# Altium schematic sheet 14_IO_MIPI.SchDoc
size A3; DocumentNumber: 14; SheetNumber: 14; SheetTotal: 21
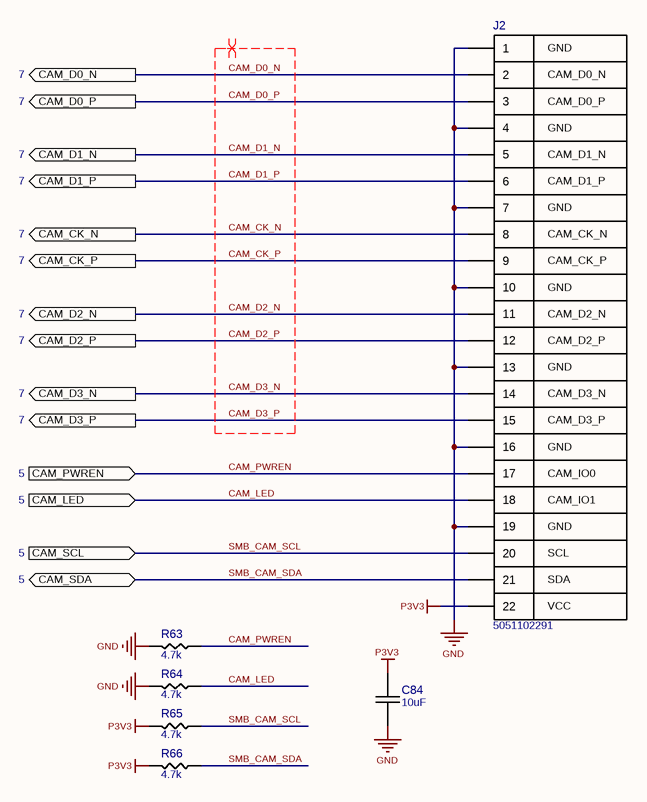
[diagram p0: 14_IO_MIPI.SchDoc]

## Parts
C84  10uF  [CAPC1005X06N]
J2  5051102291  [MOLEX_5051102291]
R63  4.7k  [RESC1005X03N]
R64  4.7k  [RESC1005X03N]
R65  4.7k  [RESC1005X03N]
R66  4.7k  [RESC1005X03N]

## Ports
CAM_CK_N (out, see 7), CAM_CK_P (out, see 7), CAM_D0_N (out, see 7), CAM_D0_P (out, see 7), CAM_D1_N (out, see 7), CAM_D1_P (out, see 7), CAM_D2_N (out, see 7), CAM_D2_P (out, see 7), CAM_D3_N (out, see 7), CAM_D3_P (out, see 7), CAM_LED (in, see 5), CAM_PWREN (in, see 5), CAM_SCL (in, see 5), CAM_SDA (bidir, see 5)

## Nets
GND: C84.1 J2.1 J2.4 J2.7 J2.10 J2.13 J2.16 J2.19 R63.2 R64.2
P3V3: C84.2 J2.22 R65.2 R66.2
CAM_CK_N: J2.8 ; port CAM_CK_N
CAM_CK_P: J2.9 ; port CAM_CK_P
CAM_D0_N: J2.2 ; port CAM_D0_N
CAM_D0_P: J2.3 ; port CAM_D0_P
CAM_D1_N: J2.5 ; port CAM_D1_N
CAM_D1_P: J2.6 ; port CAM_D1_P
CAM_D2_N: J2.11 ; port CAM_D2_N
CAM_D2_P: J2.12 ; port CAM_D2_P
CAM_D3_N: J2.14 ; port CAM_D3_N
CAM_D3_P: J2.15 ; port CAM_D3_P
CAM_LED: J2.18 R64.1 ; port CAM_LED
CAM_PWREN: J2.17 R63.1 ; port CAM_PWREN
SMB_CAM_SCL: J2.20 R65.1 ; port CAM_SCL
SMB_CAM_SDA: J2.21 R66.1 ; port CAM_SDA

## Layout directives
differential pair; differential pair class 100D: CAM_CK_N, CAM_CK_P, CAM_D0_N, CAM_D0_P, CAM_D1_N, CAM_D1_P, CAM_D2_N, CAM_D2_P, CAM_D3_N, CAM_D3_P

## Notes on the sheet
- (near J2) GND
- (near J2) CAM_D0_N
- (near J2) CAM_D0_P
- (near J2) CAM_D1_N
- (near J2) CAM_D1_P
- (near J2) CAM_CK_N
- (near J2) CAM_CK_P
- (near J2) CAM_D2_N
- (near J2) CAM_D2_P
- (near J2) CAM_D3_N
- (near J2) CAM_D3_P
- (near J2) CAM_IO0
- (near J2) CAM_IO1
- (near J2) SCL
- (near J2) SDA
- (near J2) VCC

## Library data of the parts
C84 = GRM155R60J106ME47D: CAP CER 10UF 6.3V X5R 0402; Manufacturer 1: Murata Electronics; Tol: 20%; Part Number: GRM155R60J106ME47D; Value: 10uF; Voltage: 6.3V; TempC: X5R; Manufacturer Part Number 1: GRM155R60J106ME47D; Supplier 1: Digi-Key; Supplier Part Number 1: 490-13239-1-ND
J2 = 5051102291: CONN FFC/FPC BOTTOM 22P .5MM R/A; Manufacturer 1: Molex; Part Number: 5051102291; Manufacturer Part Number 1: 5051102291; Supplier 1: Digi-Key; Supplier Part Number 1: WM11288CT-ND
R63-R66 = RC0402FR-074K7L: RES SMD 4.7K OHM 1% 1/16W 0402; Manufacturer 1: Yageo; Part Number: RC0402FR-074K7L; Value: 4.7k; Tol: 1%; Manufacturer Part Number 1: RC0402FR-074K7L; Supplier 1: Digi-Key; Supplier Part Number 1: 311-4.7KLRCT-ND